# EAGLE design LED driver(final) (EAGLE 7.1.0)
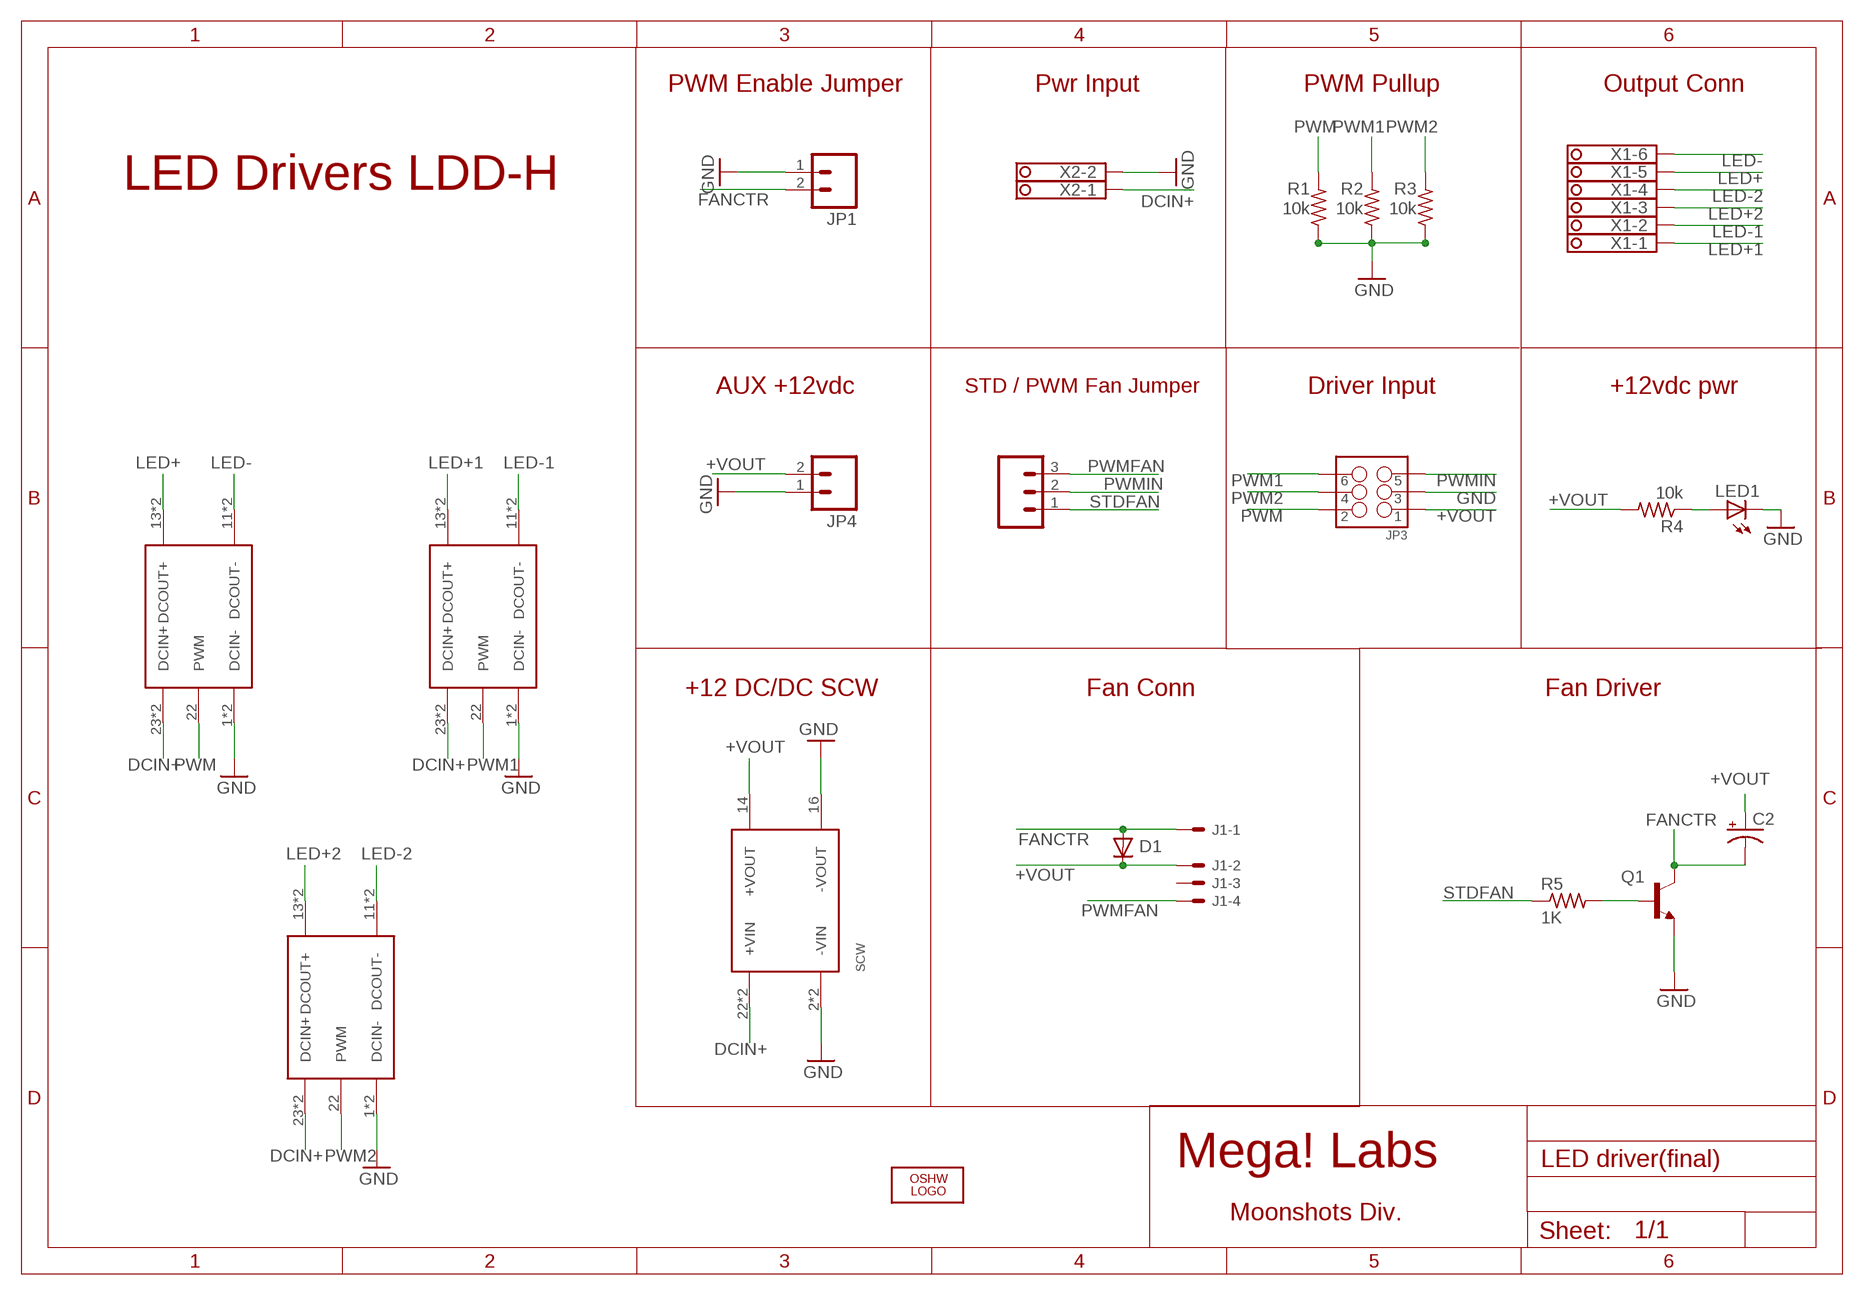
[diagram p0: schematic, sheet 1]

## Parts
C2  CPOL-USE3.5-8  [E3,5-8]
D1  CGRM4007-G  [SOD-123_MINI-SMA]
J1  22-05-7048-04  [7395-04]
JP1  M02LOCK  [1X02_LOCK]
JP2  M03LOCK  [1X03_LOCK]
JP3  M03X2SHROUD  [2X3-SHROUDED]
JP4  M02-JST-2MM-SMT  [JST-2-SMD]
LED1  LEDCHIPLED_1206  [CHIPLED_1206]
LOGO2  OSHW_LOGO_6MILX0150-NT  [OSHW_6X150_NOTEXT]
Q1  BC808-NPN-SOT23-BEC  [SOT23-BEC]
R1  10k  R-US_M1206  [M1206]
R2  10k  R-US_M1206  [M1206]
R3  10k  R-US_M1206  [M1206]
R4  10k  R-US_M1206  [M1206]
R5  1K  R-US_M1206  [M1206]
U$1  LDD_H  [LDD_H]
U$2  LDD_H  [LDD_H]
U$3  LDD_H  [LDD_H]
U$5  SCW  [SCW]
X1  1751280  [1751280]
X2  1751248  [1751248]

## Nets
+VOUT: C2.+ D1.C J1.2 JP3.1 JP4.2 R4.2 U$5.14(+VOUT)
C: Q1.B R5.2
DCIN+: U$1.23(DCIN+) U$1.24(DCIN+) U$2.23(DCIN+) U$2.24(DCIN+) U$3.23(DCIN+) U$3.24(DCIN+) U$5.22(+VIN) U$5.23(+VIN) X2.1
FANCTR: C2.- D1.A J1.1 JP1.2 Q1.C
GND: JP1.1 JP3.3 JP4.1 LED1.C Q1.E R1.1 R2.1 R3.1 U$1.1(DCIN-) U$1.2(DCIN-) U$2.1(DCIN-) U$2.2(DCIN-) U$3.1(DCIN-) U$3.2(DCIN-) U$5.2(-VIN) U$5.3(-VIN) U$5.16(-VOUT) X2.2
LED+: U$1.13(DCOUT+) U$1.14(DCOUT+) X1.5
LED+1: U$2.13(DCOUT+) U$2.14(DCOUT+) X1.1
LED+2: U$3.13(DCOUT+) U$3.14(DCOUT+) X1.3
LED-: U$1.11(DCOUT-) U$1.12(DCOUT-) X1.6
LED-1: U$2.11(DCOUT-) U$2.12(DCOUT-) X1.2
LED-2: U$3.11(DCOUT-) U$3.12(DCOUT-) X1.4
N$6: LED1.A R4.1
PWM: JP3.2 R1.2 U$1.22(PWM)
PWM1: JP3.6 R2.2 U$2.22(PWM)
PWM2: JP3.4 R3.2 U$3.22(PWM)
PWMFAN: J1.4 JP2.3
PWMIN: JP2.2 JP3.5
STDFAN: JP2.1 R5.1
Unconnected: J1.3

## Notes on the sheet
- PWM Enable Jumper | Pwr Input | PWM Pullup | Output Conn
- LED Drivers LDD-H
- AUX +12vdc | STD / PWM Fan Jumper | Driver Input | +12vdc pwr
- +12 DC/DC SCW | Fan Conn | Fan Driver
- Mega! Labs
- Moonshots Div.

## Library data of the parts
C2 = adafruit:CPOL-US: POLARIZED CAPACITOR, American symbol
D1 = diode:CGRM400*-G: Molded plasitc,JEDEC SOD-123/Mini SMA Source: Comchip CGRM4001-G.pdf
J1 = con-molex:22-?-04: CONNECTOR wire to board 2.54 mm (.1 inch) pitch header; OC_FARNELL: unknown; OC_NEWARK: unknown
JP1 = SparkFun-Connectors:M02: Standard 2-pin 0.1" header. Use with - straight break away headers ( PRT-00116) - right angle break away headers (PRT-00553) - swiss pins (PRT-00743) - machine pins (PRT-00117) - female headers (PRT-00115) Molex polarized connector foot print use with: PRT-08233 with associated crimp pins and housings. 2.54_SCREWTERM for use with PRT-10571. 3.5mm Screw Terminal footprints for PRT-08084 5mm Screw Terminal footprints for use with PRT-08433
JP2 = SparkFun-Connectors:M03: Header 3 Standard 3-pin 0.1" header. Use with straight break away headers (SKU : PRT-00116), right angle break away headers (PRT-00553), swiss pins (PRT-00743), machine pins (PRT-00117), and female headers (PRT-00115). Molex polarized connector foot print use with SKU : PRT-08232 with associated crimp pins and housings.
JP3 = SparkFun-Connectors:M03X2: 2x3 .1" header. Shrouded, with keying- CONN-10681 SMT- CONN-11415 Pogo pins- HW-11044; PROD_ID: CONN-10681
JP4 = SparkFun-Connectors:M02: Standard 2-pin 0.1" header. Use with - straight break away headers ( PRT-00116) - right angle break away headers (PRT-00553) - swiss pins (PRT-00743) - machine pins (PRT-00117) - female headers (PRT-00115) Molex polarized connector foot print use with: PRT-08233 with associated crimp pins and housings. 2.54_SCREWTERM for use with PRT-10571. 3.5mm Screw Terminal footprints for PRT-08084 5mm Screw Terminal footprints for use with PRT-08433; PROD_ID: CONN-08352
LED1 = led:LED: LED OSRAM: - CHIPLED LG R971, LG N971, LY N971, LG Q971, LY Q971, LO R971, LY R971 LH N974, LH R974 LS Q976, LO Q976, LY Q976 LO Q996 - Hyper CHIPLED LW Q18S LB Q993, LB Q99A, LB R99A - SideLED LS A670, LO A670, LY A670, LG A670, LP A670 LB A673, LV A673, LT A673, LW A673 LH A674 LY A675 LS A676, LA A676, LO A676, LY A676, LW A676 LS A679, LY A679, LG A679 - Hyper Micro SIDELED® LS Y876, LA Y876, LO Y876, LY Y876 LT Y87S - SmartLED LW L88C, LW L88S LB L89C, LB L89S, LG L890 LS L89K, LO L89K, LY L89K LS L896, LA L896, LO L896, LY L896 - TOPLED LS T670, LO T670, LY T670, LG T670, LP T670 LSG T670, LSP T670, LSY T670, LOP T670, LYG T670 LG T671, LOG T671, LSG T671 LB T673, LV T673, LT T673, LW T673 LH T674 LS T676, LA T676, LO T676, LY T676, LB T676, LH T676, LSB T676, LW T676 LB T67C, LV T67C, LT T67C, LS T67K, LO T67K, LY T67K, LW E67C LS E67B, LA E67B, LO E67B, LY E67B, LB E67C, LV E67C, LT E67C LW T67C LS T679, LY T679, LG T679 LS T770, LO T770, LY T770, LG T770, LP T770 LB T773, LV T773, LT T773, LW T773 LH T774 LS E675, LA E675, LY E675, LS T675 LS T776, LA T776, LO T776, LY T776, LB T776 LHGB T686 LT T68C, LB T68C - Hyper Mini TOPLED® LB M676 - Mini TOPLED Santana® LG M470 LS M47K, LO M47K, LY M47K Source: http://www.osram.convergy.de LUXEON: - LUMILED® LXK2-PW12-R00, LXK2-PW12-S00, LXK2-PW14-U00, LXK2-PW14-V00 LXK2-PM12-R00, LXK2-PM12-S00, LXK2-PM14-U00 LXK2-PE12-Q00, LXK2-PE12-R00, LXK2-PE12-S00, LXK2-PE14-T00, LXK2-PE14-U00 LXK2-PB12-K00, LXK2-PB12-L00, LXK2-PB12-M00, LXK2-PB14-N00, LXK2-PB14-P00, LXK2-PB14-Q00 LXK2-PR12-L00, LXK2-PR12-M00, LXK2-PR14-Q00, LXK2-PR14-R00 LXK2-PD12-Q00, LXK2-PD12-R00, LXK2-PD12-S00 LXK2-PH12-R00, LXK2-PH12-S00 LXK2-PL12-P00, LXK2-PL12-Q00, LXK2-PL12-R00 Source: www.luxeon.com KINGBRIGHT: KA-3528ASYC Source: www.kingbright.com
LOGO2 = ohw-logo:OSHW_LOGO_6MIL
Q1 = transistor:*-NPN-: NPN Transistror BF959 corrected 2008.03.06
R1-R5 = resistor:R-US_: RESISTOR, American symbol
U$1-U$3 = meanwell_dcdc:LDD_H
U$5 = meanwell_dcdc_LDD-H footprint:SCW: Meanwell DC/DC SCW[Power][Vin]-[Vout] Constant Voltage Power: 03= 3 watt 05= 5 watt 08= 8 watt Vin: A= 9 - 18V B= 18 - 36V C= 36 - 72V Vout: 05= 5V 09= 9V (not 3 or 8 watt) 12= 12V 15= 15V Currents: 3 watt: 5V= 60 - 600mA 12V= 25 - 250mA 15V= 20 - 200mA 5 watt: 5V= 200 - 1000mA 9V= 111 - 556mA 12V= 94 - 470mA 15V= 80 - 400mA 8 watt: 5V= 320 - 1600mA 12V= 134 - 670mA 15V= 106 - 533mA
X1 = con-phoenix-350:1751280: MKDS 1/ 6-3,5 Printklemme Nennstrom: 10 A Bemessungsspannung: 160 V Raster: 3,5 mm Polzahl: 6 Montageart: Löten Anschlussart: Schraubanschluss Anschlussrichtung vom Leiter zur Platine: 0° Source: http://eshop.phoenixcontact.com .. 1751280.pdf; MPN: 1751280; OC_FARNELL: unknown; OC_NEWARK: 27R1765
X2 = con-phoenix-350:1751248: MKDS 1/ 2-3,5 Printklemme Nennstrom: 10 A Bemessungsspannung: 160 V Raster: 3,5 mm Polzahl: 2 Montageart: Löten Anschlussart: Schraubanschluss Anschlussrichtung vom Leiter zur Platine: 0° Source: http://eshop.phoenixcontact.com .. 1751248.pdf; OC_FARNELL: unknown; OC_NEWARK: unknown

## Net classes
0 default: width 0.254 mm, drill 0.508 mm

## Board
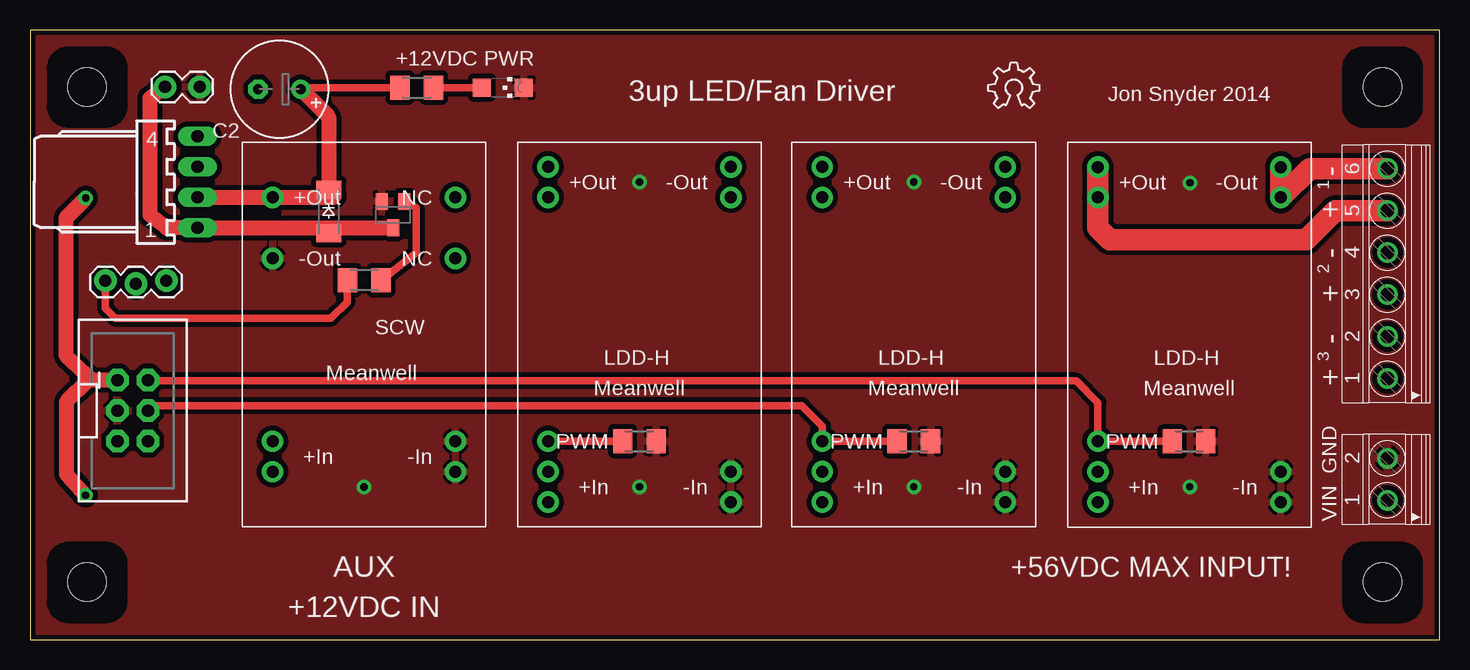
[diagram p1: board, top side]
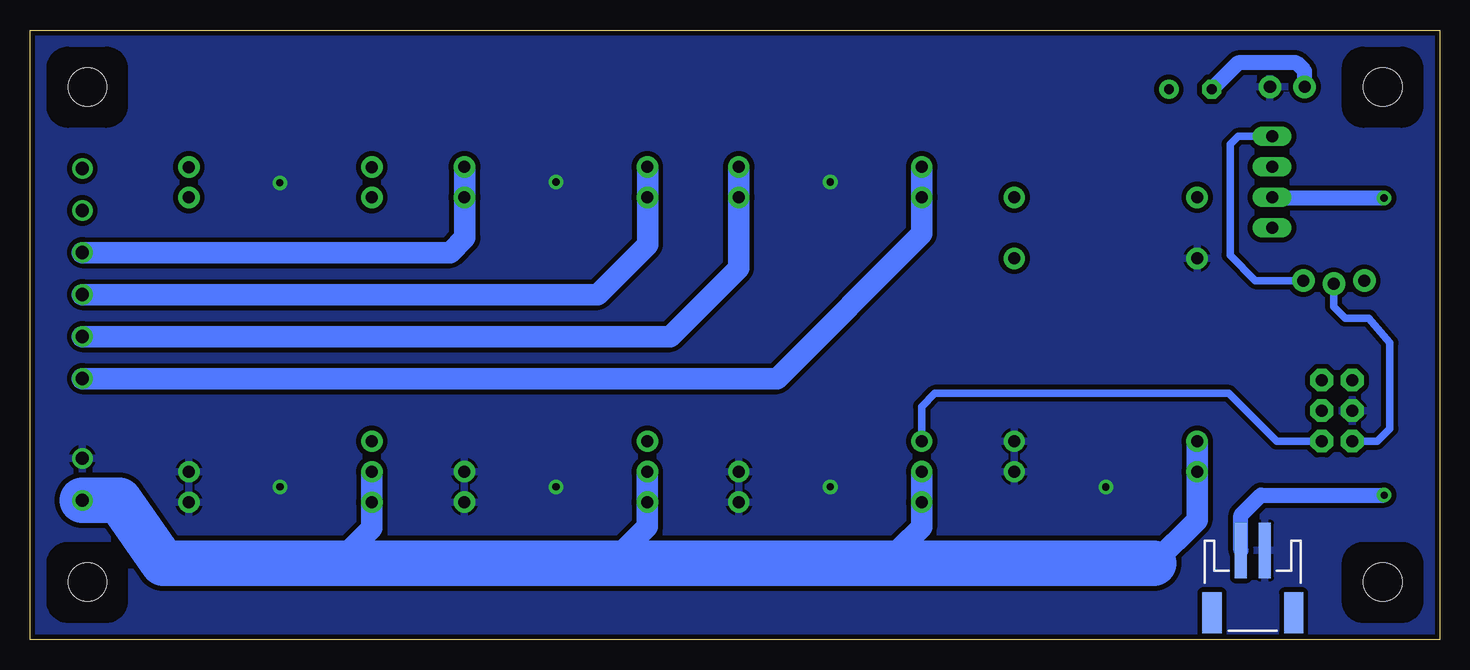
[diagram p2: board, bottom side, seen from below]

Size 117.47 x 50.8 mm. Coordinates in mm from the lower left corner, seen from the top.
Outline: 0,50.8 0,0 117.47,0 117.47,50.8 0,50.8
Copper layers (1*16): Top 0.0356mm / dielectric 1.5011mm / Bottom 0.0356mm
Design rules "LaenPCBOrder *": minimum track width 6mil, minimum drill 13mil, track to track 6mil, track to pad 6mil, pad to pad 6mil, via to via 6mil, smd to smd 6mil, copper to edge 15mil, drill to drill 6mil, minimum pad ring 12mil, minimum via ring 12mil, stop-mask expansion 4mil, vias tented up to drill 20mil, thermal gap 10mil
Holes 3.2 mm at 4.75,46.06 4.75,4.79 112.7,46.06 112.7,4.79

### Footprints (pad centres in the part's own frame; a part is rotated, then mirrored left to right if it is on the bottom)
E3,5-8 = drill 0.813 pad 1.6: + -1.778,0 | drill 0.813 pad 1.6 octagon: - 1.778,0
SOD-123_MINI-SMA = smd 1.5 x 2.1: A 1.8,0; C -1.8,0
7395-04 = drill 1.016 long: 1 3.81,0; 2 1.27,0; 3 -1.27,0; 4 -3.81,0
1X02_LOCK = drill 1.016 pad 1.88: 1 -0.178,0; 2 2.718,0
1X03_LOCK = drill 1.016 pad 1.88: 1 0,0.127; 2 2.54,-0.127; 3 5.08,0.127
2X3-SHROUDED = drill 1.016 pad 1.88 octagon: 1 -1.27,2.54; 2 1.27,2.54; 3 -1.27,0; 4 1.27,0; 5 -1.27,-2.54; 6 1.27,-2.54
JST-2-SMD = smd 1 x 4.6: 1 -1,-3.7; 2 1,-3.7 | smd 1.6 x 3.4: NC1 -3.4,1.5; NC2 3.4,1.5
CHIPLED_1206 = smd 1.5 x 1.5: A 0,-1.75; C 0,1.75
SOT23-BEC = smd 1 x 1.4: B -0.95,-1.1; C 0,1.1; E 0.95,-1.1
M1206 = smd 1.6 x 2: 1 -1.4,0; 2 1.4,0
LDD_H = drill 1 pad 1.778: 1 -7.62,13.97; 2 -7.62,11.43; 11 -7.62,-11.43; 12 -7.62,-13.97; 13 7.62,-13.97; 14 7.62,-11.43; 22 7.62,8.89; 23 7.62,11.43; 24 7.62,13.97
SCW = drill 1 pad 1.778: 2 -7.62,11.43; 3 -7.62,8.89; 9 -7.62,-6.35; 11 -7.62,-11.43; 14 7.62,-11.43; 16 7.62,-6.35; 22 7.62,8.89; 23 7.62,11.43
1751280 = drill 1.1 pad 1.7: 1 -8.75,-0.1; 2 -5.25,-0.1; 3 -1.75,-0.1; 4 1.75,-0.1; 5 5.25,-0.1; 6 8.75,-0.1
1751248 = drill 1.1 pad 1.7: 1 -1.75,-0.1; 2 1.75,-0.1

### Placement (x,y rotation side)
C2  20.78,45.86 180 top
D1  24.89,35.67 270 top
J1  13.96,38.13 270 top
JP1  13.97,46.06 180 top
JP2  6.28,29.78 0 top
JP3  8.56,19.08 0 top
JP4  15.57,3.73 180 bottom
LED1  39.41,45.99 270 top
LOGO2  79.86,44.3 0 top
Q1  30.25,35.41 180 top
R1  96.58,16.52 180 top
R2  50.79,16.54 180 top
R3  73.65,16.54 180 top
R4  32.23,45.99 180 top
R5  27.85,29.96 0 top
U$1  96.61,25.41 180 top
U$2  50.79,25.43 180 top
U$3  73.65,25.43 180 top
U$5  27.83,25.42 180 top
X1  113.02,30.51 90 top
X2  113.02,13.36 90 top

### Tracks (layer width: path | path; a pad name or v marks a point on that pad's centre or on a via)
+VOUT  (via drill 0.6)
  Top 0.61: 22.46,45.99 R4.2
  Top 1.27: J1.2 23.49,36.86 | U$5.14 23.49,36.85 23.49,36.86 | 23.49,36.86 25.25,36.86 25.32,36.93 25.32,37.04 D1.C | v4.62,12.03 3.03,13.78 3.03,19.81 4.84,21.62 JP3.1 5.2,21.62 3.03,23.62 3.03,35.21 3.05,35.21 v4.64,36.8 | D1.C 25.15,37.48 | 22.46,45.99 22.59,45.86 | D1.C 24.89,43.56 23.3,45.15 22.59,45.86 | C2.+ 22.59,45.86
  Bottom 1.27: 13.96,36.84 J1.2 | J1.2 | v4.64,36.8 13.9,36.8 J1.2 | JP4.2 16.57,10.37 14.91,12.03 v4.62,12.03
C
  Top 0.61: Q1.B 31.32,36.51 32.18,35.97 32.18,32.25 R5.2
DCIN+
  Bottom 1.778: 45.26,6.35 45.26,6.79 44.99,7.06 44.99,7.56 43.17,9.38 U$2.24 U$2.23 | 23.81,6.35 20.21,9.95 U$5.23 U$5.22 | U$1.23 U$1.24 88.99,9.28 91.28,6.99 | U$3.23 U$3.24 66.03,9.97 66.03,9.4 69.08,6.35
  Bottom 2.54: 92.07,6.35 91.44,6.99 91.28,6.99
  Bottom 3.81: 23.81,6.35 45.26,6.35 69.08,6.35 92.07,6.35 106.36,6.35 110.04,11.61 X2.1
FANCTR
  Top 0.406: Q1.C 29.74,34.31 29.74,34.32
  Top 0.61: 29.74,34.32 25.33,34.32 D1.A
  Top 1.27: 29.74,34.32 J1.1 11.39,34.32 10.02,35.37 10.02,45.15 JP1.2
  Bottom 1.27: JP1.2 11.25,47.4 11.92,48.07 16.8,48.07 C2.-
GND  (via drill 0.6)
  other vias: 50.79,12.73 73.65,12.73 96.65,12.73 96.66,38.06 73.65,38.13 50.79,38.13 27.83,12.71
  pour Bottom (isolate 0.406): 0,50.8 0,0 117.47,0 117.47,50.8
  pour Top (isolate 0.406): 0,50.8 0,0 117.47,0 117.47,50.8
LED+
  Top 1.778: U$1.13 U$1.14 88.99,34.32 89.97,33.34 106.36,33.34 108.78,35.76 X1.5
LED+1
  Bottom 1.778: X1.1 55.22,21.76 43.17,33.81 U$2.14 U$2.13
LED+2
  Bottom 1.676: 66.01,39.38 66.01,36.87 U$3.14
  Bottom 1.778: X1.3 70.18,28.76 66.01,32.92 66.01,39.38 U$3.13
LED-
  Top 1.778: X1.6 106.64,39.26 U$1.11 U$1.12
LED-1
  Bottom 1.676: 58.43,39.37 58.43,36.88 U$2.11
  Bottom 1.778: X1.2 64.13,25.26 58.43,30.95 58.43,39.37 U$2.12
LED-2
  Bottom 1.676: 81.24,39.37 81.24,36.88 U$3.11
  Bottom 1.778: X1.4 82.46,32.26 81.24,33.48 81.24,39.37 U$3.12
N$1
  cutout Top: 1.59,44.45 arc90 3.18,42.86 6.35,42.86 arc90 7.94,44.45 7.94,47.62 arc90 6.35,49.21 3.18,49.21 arc90 1.59,47.62
  cutout Top: 109.54,3.17 arc90 111.12,1.59 114.3,1.59 arc90 115.89,3.17 115.89,6.35 arc90 114.3,7.94 111.12,7.94 arc90 109.54,6.35
  cutout Top: 109.54,44.45 arc90 111.12,42.86 114.3,42.86 arc90 115.89,44.45 115.89,47.62 arc90 114.3,49.21 111.12,49.21 arc90 109.54,47.62
  cutout Bottom: 1.59,3.17 arc90 3.18,1.59 6.35,1.59 arc90 7.94,3.17 7.94,6.35 arc90 6.35,7.94 3.18,7.94 arc90 1.59,6.35
  cutout Bottom: 1.59,44.45 arc90 3.18,42.86 6.35,42.86 arc90 7.94,44.45 7.94,47.62 arc90 6.35,49.21 3.18,49.21 arc90 1.59,47.62
  cutout Bottom: 109.54,3.17 arc90 111.12,1.59 114.3,1.59 arc90 115.89,3.17 115.89,6.35 arc90 114.3,7.94 111.12,7.94 arc90 109.54,6.35
  cutout Bottom: 109.54,44.45 arc90 111.12,42.86 114.3,42.86 arc90 115.89,44.45 115.89,47.62 arc90 114.3,49.21 111.12,49.21 arc90 109.54,47.62
  cutout Bottom: 1.59,3.17 arc90 3.18,1.59 6.35,1.59 arc90 7.94,3.17 7.94,6.35 arc90 6.35,7.94 3.18,7.94 arc90 1.59,6.35
  cutout Top: 1.59,44.45 arc90 3.18,42.86 6.35,42.86 arc90 7.94,44.45 7.94,47.62 arc90 6.35,49.21 3.18,49.21 arc90 1.59,47.62
  cutout Top: 1.59,3.17 arc90 3.18,1.59 6.35,1.59 arc90 7.94,3.17 7.94,6.35 arc90 6.35,7.94 3.18,7.94 arc90 1.59,6.35
N$6
  Top 0.61: R4.1 LED1.A
PWM
  Top 0.61: R1.2 U$1.22 88.99,19.74 87.17,21.56 9.89,21.56 JP3.2
PWM1
  Top 0.61: R2.2 U$2.22
  Bottom 0.61: JP3.6 13.59,16.54 17.56,20.51 42.07,20.51 43.17,19.42 U$2.22
PWM2
  Top 0.61: R3.2 U$3.22 66.03,17.78 64.31,19.49 10.25,19.49 JP3.4
PWMFAN
  Bottom 0.61: J1.4 16.8,41.94 17.46,41.27 17.46,32.03 15.35,29.92 11.38,29.92 JP2.3
PWMIN
  Bottom 0.61: JP3.5 5.2,16.54 4.15,17.59 4.15,24.73 5.89,26.8 7.88,26.8 8.83,27.75 JP2.2
STDFAN
  Top 0.61: JP2.1 6.28,27.6 7.1,26.78 25.07,26.78 26.42,28.13 26.42,29.93 R5.1

### Text on the board
tPlace: +12VDC PWR | AUX | +56VDC MAX INPUT! | +12VDC IN
_tsilk: 3up LED/Fan Driver | Jon Snyder 2014 | - | 1 | + | - | 2 | + | - | 3 | + | GND | VIN